# EAGLE design atarimovie (EAGLE 9.6.2)
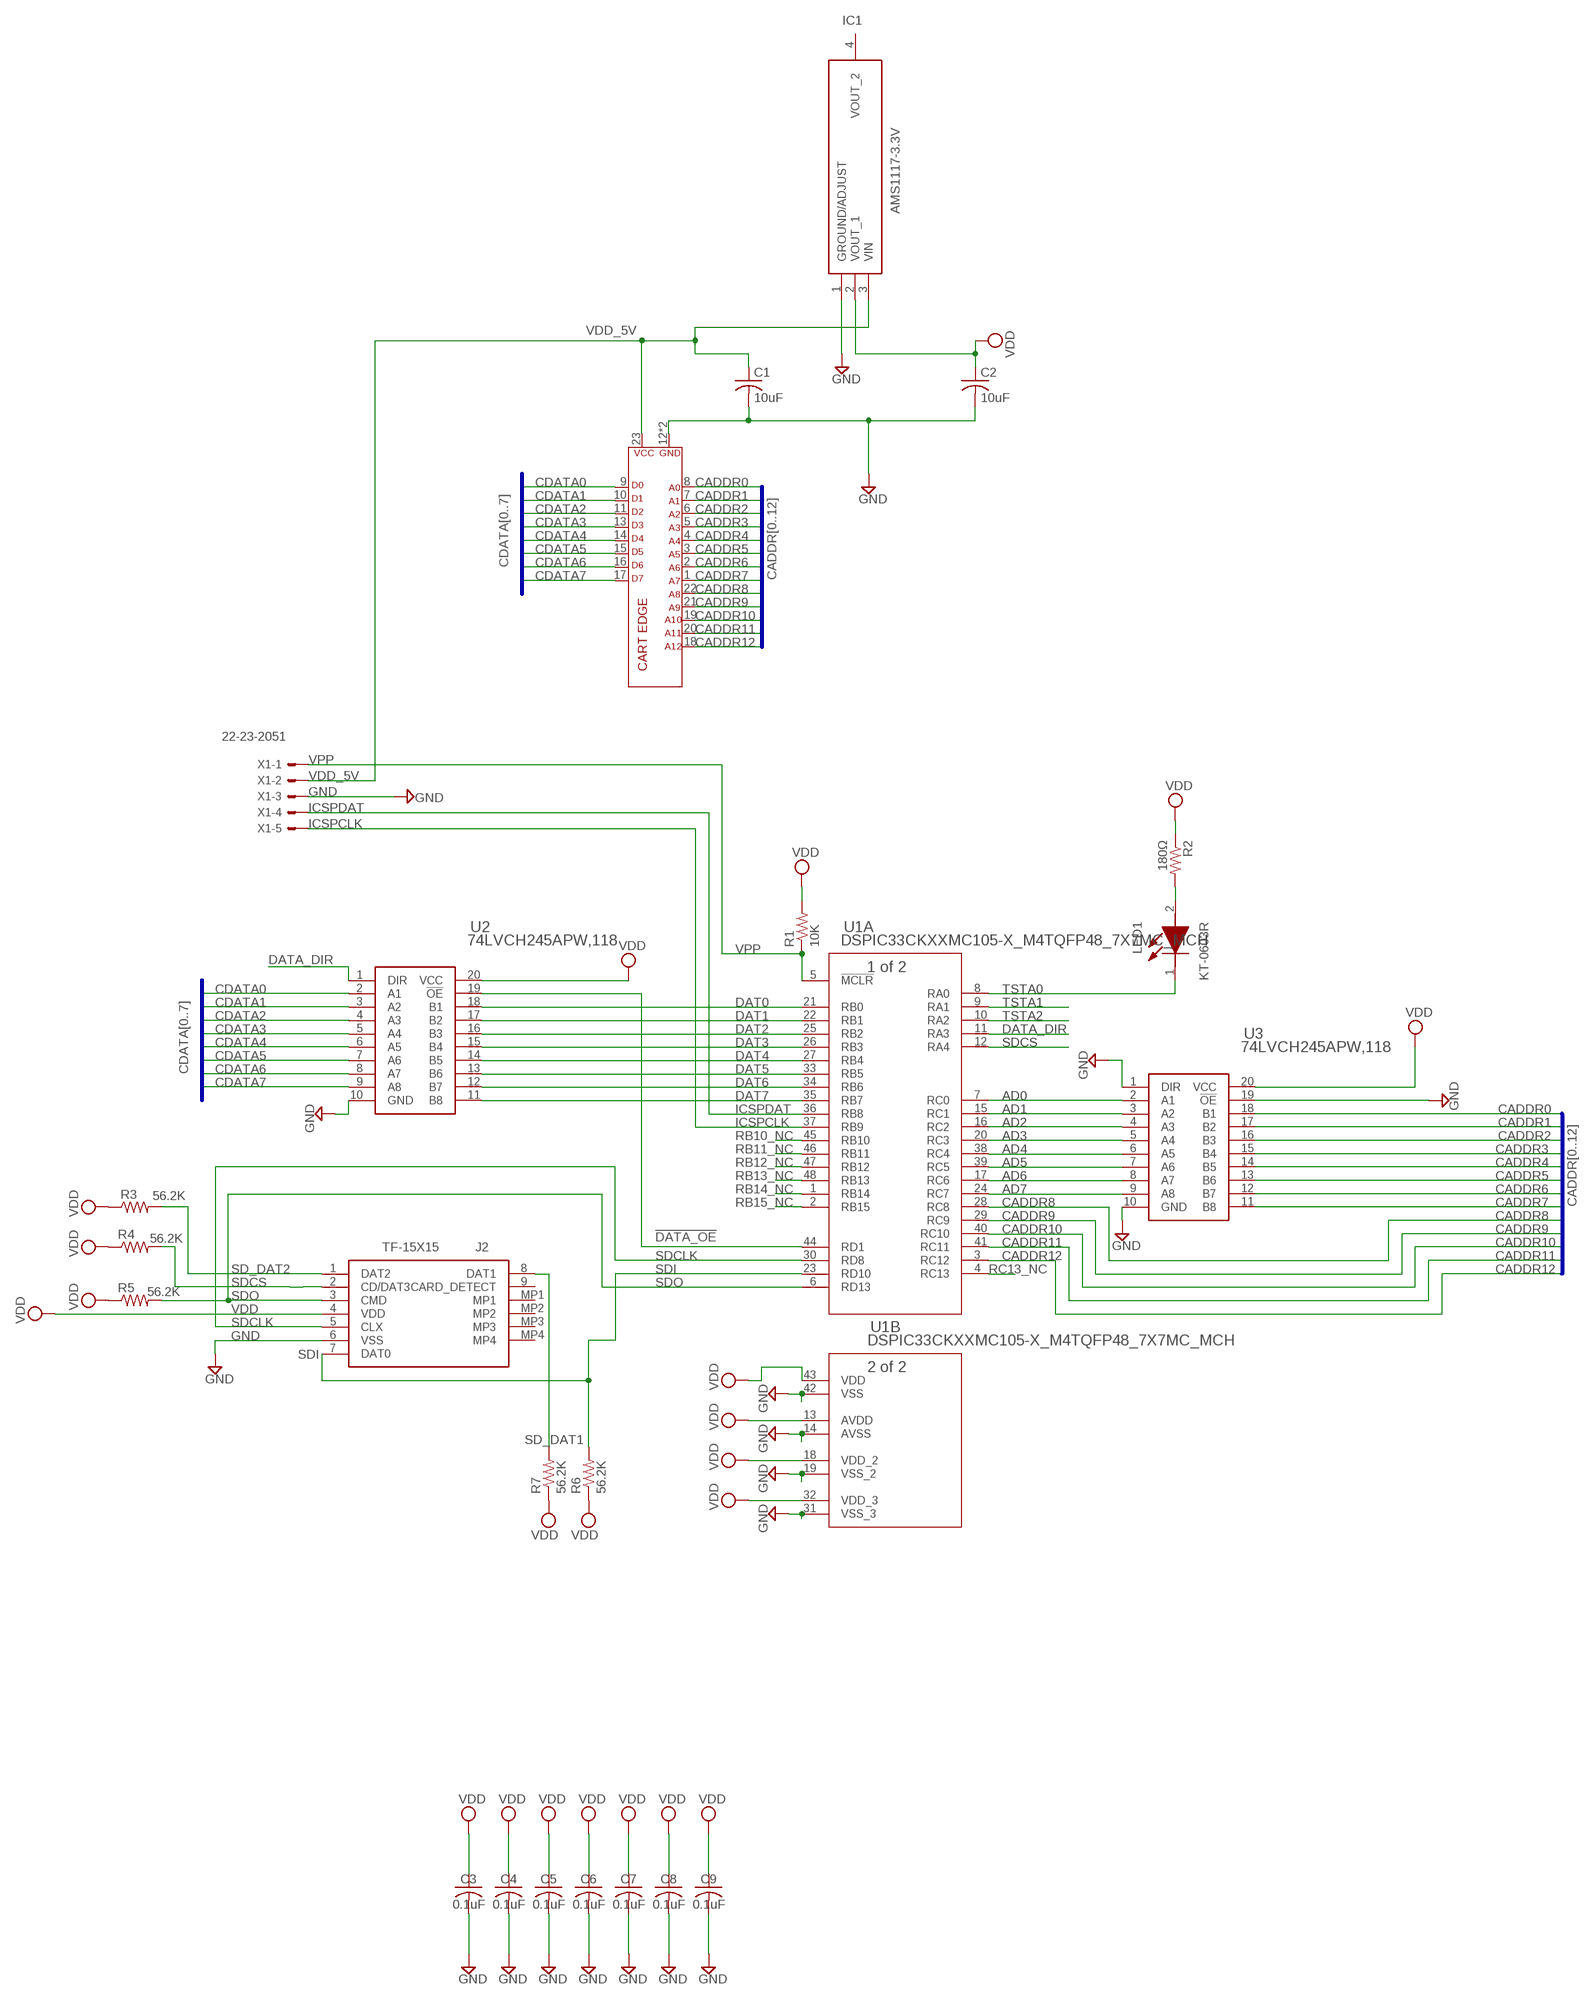
[diagram p0: schematic, sheet 1]

## Parts
C1  10uF  C-USC0603K  [C0603K]
C2  10uF  C-USC0603K  [C0603K]
C3  0.1uF  C-USC0603K  [C0603K]
C4  0.1uF  C-USC0603K  [C0603K]
C5  0.1uF  C-USC0603K  [C0603K]
C6  0.1uF  C-USC0603K  [C0603K]
C7  0.1uF  C-USC0603K  [C0603K]
C8  0.1uF  C-USC0603K  [C0603K]
C9  0.1uF  C-USC0603K  [C0603K]
IC1  AMS1117-3.3V  [SOT229P700X180-4N]
J1  CARTRIDGE EDGE  ATARI-2600MED_TABS_SHORT  [MED_TABS_SHORT]
J2  TF-15X15  [TF15X15]
LED1  KT-0603R  [LEDC1608X70N]
R1  10K  R-US_R0603  [R0603]
R2  180Ω  R-US_R0603  [R0603]
R3  56.2K  R-US_R0603  [R0603]
R4  56.2K  R-US_R0603  [R0603]
R5  56.2K  R-US_R0603  [R0603]
R6  56.2K  R-US_R0603  [R0603]
R7  56.2K  R-US_R0603  [R0603]
U1  DSPIC33CKXXMC105-X_M4TQFP48_7X7MC_MCH  [TQFP48_7X7MC_MCH]
U2  74LVCH245APW,118  [SOP65P640X110-20N]
U3  74LVCH245APW,118  [SOP65P640X110-20N]
X1  22-23-2051  [22-23-2051]

## Nets
!DATA_OE!: U1.44(A:RD1) U2.19(!OE)
AD0: U1.7(A:RC0) U3.2(A1)
AD1: U1.15(A:RC1) U3.3(A2)
AD2: U1.16(A:RC2) U3.4(A3)
AD3: U1.20(A:RC3) U3.5(A4)
AD4: U1.38(A:RC4) U3.6(A5)
AD5: U1.39(A:RC5) U3.7(A6)
AD6: U1.17(A:RC6) U3.8(A7)
AD7: U1.24(A:RC7) U3.9(A8)
CADDR0: J1.8(A0) U3.18(B1)
CADDR1: J1.7(A1) U3.17(B2)
CADDR2: J1.6(A2) U3.16(B3)
CADDR3: J1.5(A3) U3.15(B4)
CADDR4: J1.4(A4) U3.14(B5)
CADDR5: J1.3(A5) U3.13(B6)
CADDR6: J1.2(A6) U3.12(B7)
CADDR7: J1.1(A7) U3.11(B8)
CADDR8: J1.22(A8) U1.28(A:RC8)
CADDR9: J1.21(A9) U1.29(A:RC9)
CADDR10: J1.19(A10) U1.40(A:RC10)
CADDR11: J1.20(A11) U1.41(A:RC11)
CADDR12: J1.18(A12) U1.3(A:RC12)
CDATA0: J1.9(D0) U2.2(A1)
CDATA1: J1.10(D1) U2.3(A2)
CDATA2: J1.11(D2) U2.4(A3)
CDATA3: J1.13(D3) U2.5(A4)
CDATA4: J1.14(D4) U2.6(A5)
CDATA5: J1.15(D5) U2.7(A6)
CDATA6: J1.16(D6) U2.8(A7)
CDATA7: J1.17(D7) U2.9(A8)
DAT0: U1.21(A:RB0) U2.18(B1)
DAT1: U1.22(A:RB1) U2.17(B2)
DAT2: U1.25(A:RB2) U2.16(B3)
DAT3: U1.26(A:RB3) U2.15(B4)
DAT4: U1.27(A:RB4) U2.14(B5)
DAT5: U1.33(A:RB5) U2.13(B6)
DAT6: U1.34(A:RB6) U2.12(B7)
DAT7: U1.35(A:RB7) U2.11(B8)
DATA_DIR: U1.11(A:RA3) U2.1(DIR)
GND: C1.2 C2.2 C3.2 C4.2 C5.2 C6.2 C7.2 C8.2 C9.2 IC1.1(GROUND/ADJUST) J1.12(GND) J1.24(GND) J2.6(VSS) U1.14(B:AVSS) U1.19(B:VSS_2) U1.31(B:VSS_3) U1.42(B:VSS) U2.10(GND) U3.1(DIR) U3.10(GND) U3.19(!OE) X1.3
ICSPCLK: U1.37(A:RB9) X1.5
ICSPDAT: U1.36(A:RB8) X1.4
N$1: LED1.2(A) R2.2
RB10_NC: U1.45(A:RB10)
RB11_NC: U1.46(A:RB11)
RB12_NC: U1.47(A:RB12)
RB13_NC: U1.48(A:RB13)
RB14_NC: U1.1(A:RB14)
RB15_NC: U1.2(A:RB15)
RC13_NC: U1.4(A:RC13)
SD_DAT1: J2.8(DAT1) R7.2
SD_DAT2: J2.1(DAT2) R3.2
SDCLK: J2.5(CLX) U1.30(A:RD8)
SDCS: J2.2(CD/DAT3) R4.2 U1.12(A:RA4)
SDI: J2.7(DAT0) R6.2 U1.23(A:RD10)
SDO: J2.3(CMD) R5.2 U1.6(A:RD13)
TSTA0: LED1.1(K) U1.8(A:RA0)
TSTA1: U1.9(A:RA1)
TSTA2: U1.10(A:RA2)
VDD: C2.1 C3.1 C4.1 C5.1 C6.1 C7.1 C8.1 C9.1 IC1.2(VOUT_1) J2.4(VDD) R1.2 R2.1 R3.1 R4.1 R5.1 R6.1 R7.1 U1.13(B:AVDD) U1.18(B:VDD_2) U1.32(B:VDD_3) U1.43(B:VDD) U2.20(VCC) U3.20(VCC)
VDD_5V: C1.1 IC1.3(VIN) J1.23(VCC) X1.2
VPP: R1.1 U1.5(A:!MCLR) X1.1
Unconnected: IC1.4(VOUT_2) J2.9(CARD_DETECT) J2.MP1 J2.MP2 J2.MP3 J2.MP4

## Buses
CADDR[0..12]
CDATA[0..7]

## Library data of the parts
C1-C9 = rcl:C-US: CAPACITOR, American symbol; SPICEPREFIX: C
IC1 = ams1117-3.3v:AMS1117-3.3V: 1A LOW DROPOUT VOLTAGE REGULATOR, SOT-223 Source: Datasheet <http://www.advanced-monolithic.com/pdf/ds1117.pdf>; DESCRIPTION: 1A LOW DROPOUT VOLTAGE REGULATOR, SOT-223; HEIGHT: 1.8mm; MANUFACTURER_NAME: Advanced Monolithic Systems; MANUFACTURER_PART_NUMBER: ams1117-3.3v
J1 = a26board:ATARI-2600: Atari 2600 cartridge board
J2 = TF-15X15:TF-15X15: Micro-SD Card Socket Source: Datasheet <https://datasheet.lcsc.com/szlcsc/SOFNG-TF-15-15_C111196.pdf>; DESCRIPTION: Micro-SD Card Socket; HEIGHT: 1.85mm; MANUFACTURER_NAME: SOFNG; MANUFACTURER_PART_NUMBER: TF-15X15
LED1 = KT-0603R:KT-0603R: Red 615~630nm 1.9~2.2V 0603 Light Emitting Diodes (LED) RoHS Source: Datasheet <https://datasheet.lcsc.com/szlcsc/Hubei-KENTO-Elec-KT-0603R_C2286.pdf>; DESCRIPTION: Red 615~630nm 1.9~2.2V 0603 Light Emitting Diodes (LED) RoHS; HEIGHT: 0.7mm; MANUFACTURER_NAME: Hubei KENTO Elec; MANUFACTURER_PART_NUMBER: KT-0603R
R1-R7 = resistor:R-US_: RESISTOR, American symbol
U1 = parts_mc2:DSPIC33CKXXMC105-X_M4: IC MCU 16BIT 32KB FLASH 48UQFN
U2 U3 = 74LVCH245APW_118:74LVCH245APW,118: 74LVC(H)245A - Octal bus transceiver; 3-state@en-us Source: Datasheet <https://assets.nexperia.com/documents/data-sheet/74LVC_LVCH245A.pdf>; DESCRIPTION: 74LVC(H)245A - Octal bus transceiver; 3-state@en-us; HEIGHT: 1.1mm; MANUFACTURER_NAME: Nexperia; MANUFACTURER_PART_NUMBER: 74LVCH245APW,118; MOUSER_PART_NUMBER: 771-74LVCH245APW-T; MOUSER_PRICE-STOCK: https://www.mouser.co.uk/ProductDetail/Nexperia/74LVCH245APW118?qs=me8TqzrmIYU8gTXvbc8b4g%3D%3D
X1 = con-molex:22-23-2051: .100" (2.54mm) Center Header - 5 Pin; MF: MOLEX; MPN: 22-23-2051; OC_FARNELL: 1462952; OC_NEWARK: 38C9178

## Board
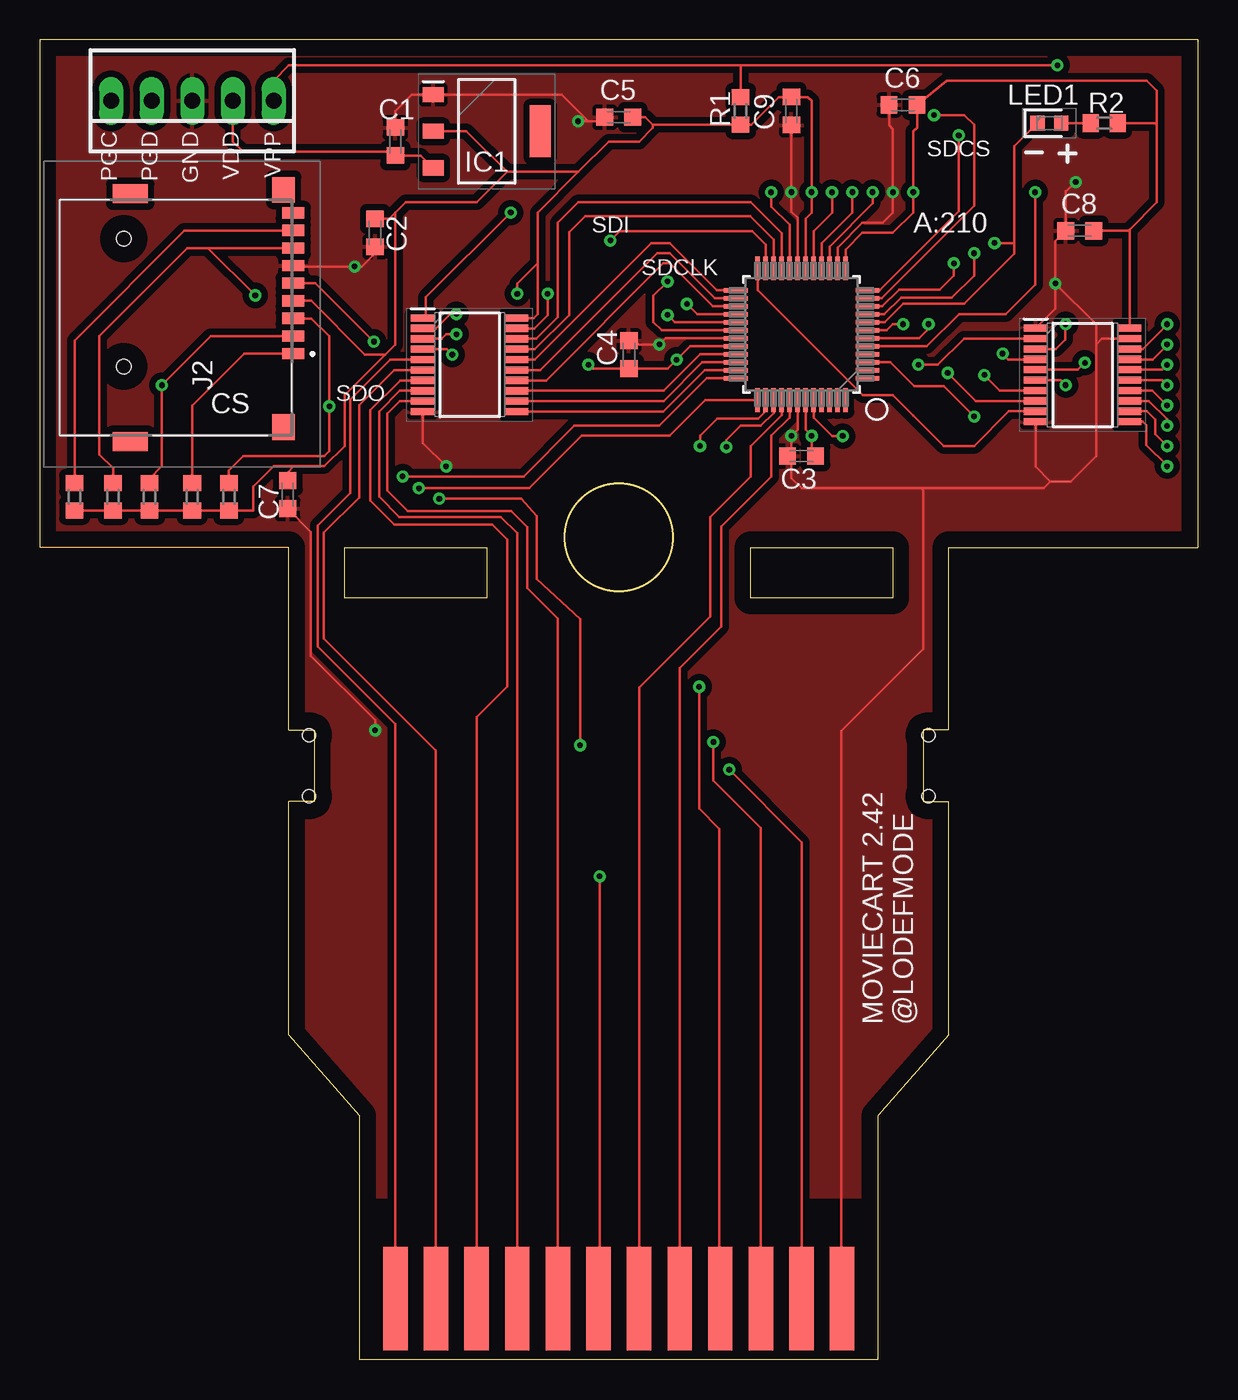
[diagram p1: board, top side]
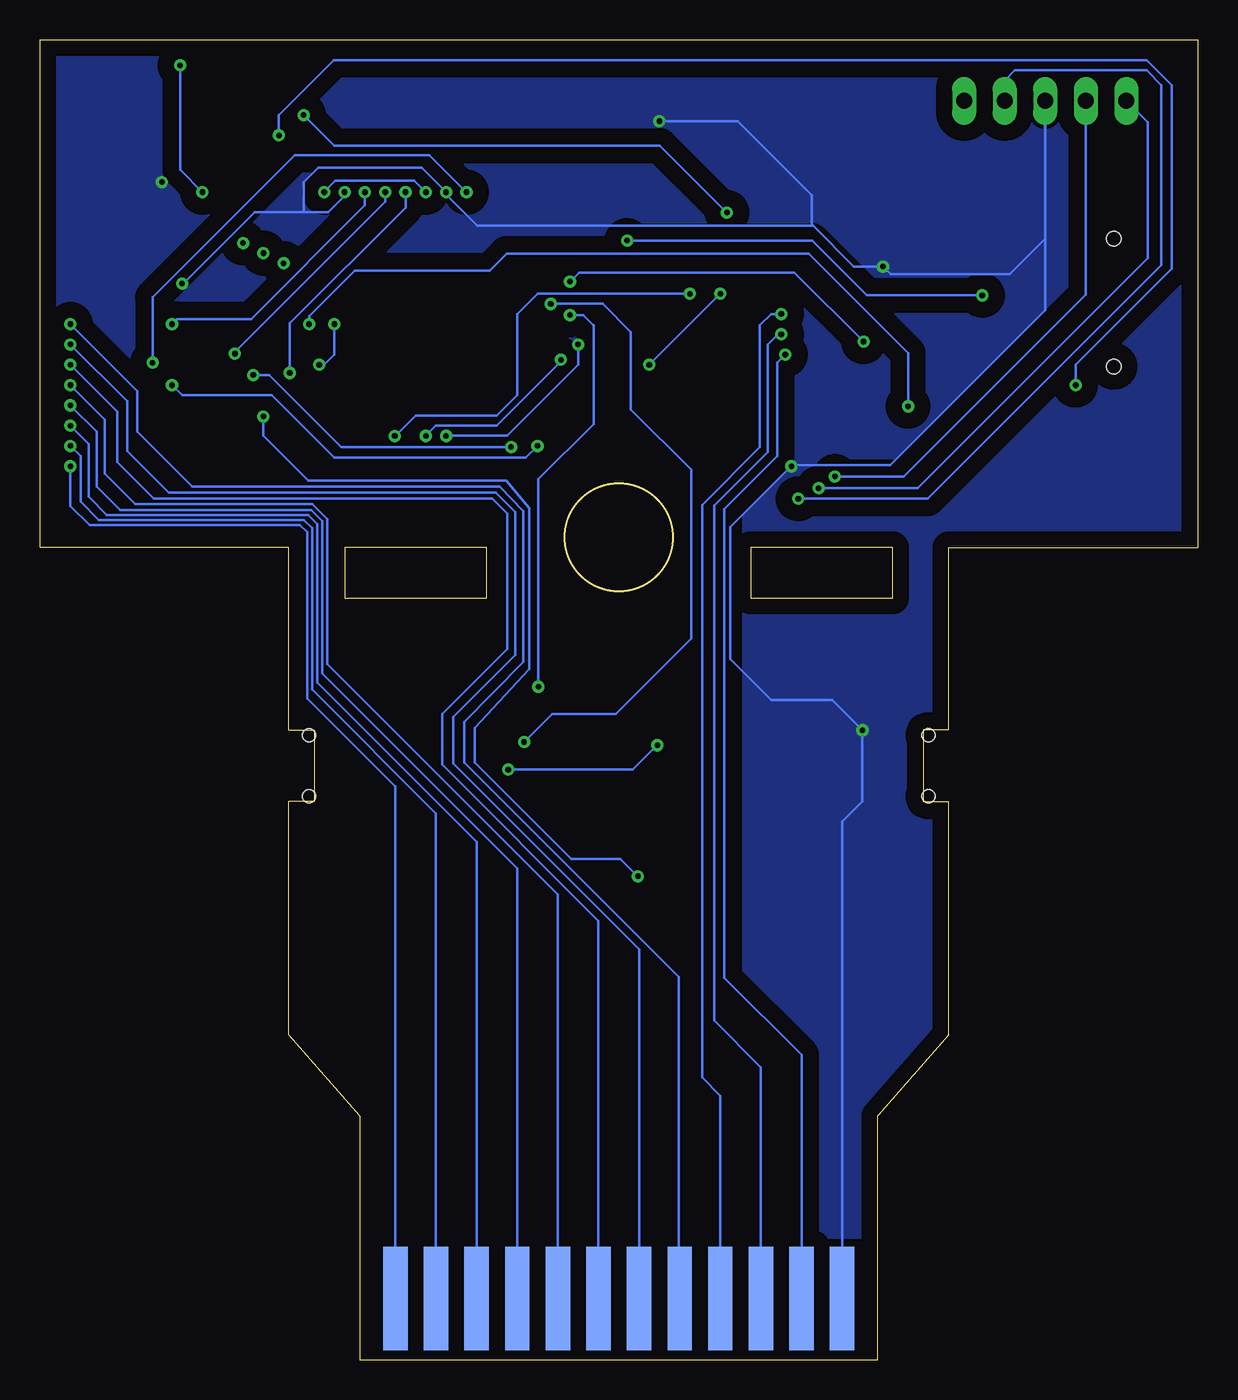
[diagram p2: board, bottom side, seen from below]

Size 72.39 x 82.55 mm. Coordinates in mm from the lower left corner, seen from the top.
Copper layers (1*16): Top 0.035mm / dielectric 1.5mm / Bottom 0.035mm
Design rules "default": minimum track width 6mil, minimum drill 0.35mm, track to track 6mil, track to pad 6mil, pad to pad 6mil, via to via 6mil, smd to smd 6mil, copper to edge 40mil, drill to drill 6mil, minimum pad ring 10mil, minimum via ring 8mil, stop-mask expansion 4mil, vias tented up to drill 0mil, thermal gap 10mil

### Footprints (pad centres in the part's own frame; a part is rotated, then mirrored left to right if it is on the bottom)
C0603K = smd 1.05 x 1.08: 1 -0.875,0; 2 0.875,0
SOT229P700X180-4N = smd 1.3 x 0.95: 1 -3.35,2.29; 2 -3.35,0; 3 -3.35,-2.29 | smd 1.3 x 3.25: 4 3.35,0
MED_TABS_SHORT = smd 1.524 x 6.477: 1 -13.97,-46.99; 2 -11.43,-46.99; 3 -8.89,-46.99; 4 -6.35,-46.99; 5 -3.81,-46.99; 6 -1.27,-46.99; 7 1.27,-46.99; 8 3.81,-46.99; 9 6.35,-46.99; 10 8.89,-46.99; 11 11.43,-46.99; 12 13.97,-46.99 | smd 1.524 x 6.477 bottom: 13 13.97,-46.99; 14 11.43,-46.99; 15 8.89,-46.99; 16 6.35,-46.99; 17 3.81,-46.99; 18 1.27,-46.99; 19 -1.27,-46.99; 20 -3.81,-46.99; 21 -6.35,-46.99; 22 -8.89,-46.99; 23 -11.43,-46.99; 24 -13.97,-46.99 | hole 0.8: -19.367,-11.748; -19.367,-15.557; 19.367,-11.748; 19.367,-15.557
TF15X15 = smd 0.7 x 1.4: 1 2.475,6.95; 2 1.375,6.95; 3 0.275,6.95; 4 -0.825,6.95; 5 -1.925,6.95; 6 -3.025,6.95; 7 -4.125,6.95; 8 -5.225,6.95; 9 -6.325,6.95 | smd 1.6 x 1.4: MP1 -7.775,6.35; MP2 7.075,6.35 | smd 1.2 x 2.2: MP3 -7.525,-3.25; MP4 7.975,-3.25 | hole 0.9: -4.725,-3.65; 3.275,-3.65
LEDC1608X70N = smd 0.9 x 0.95: 1 -0.75,0; 2 0.75,0
R0603 = smd 1 x 1.1: 1 -0.85,0; 2 0.85,0
TQFP48_7X7MC_MCH = smd 1.473 x 0.279: 1 -4.115,2.75; 2 -4.115,2.25; 3 -4.115,1.75; 4 -4.115,1.25; 5 -4.115,0.75; 6 -4.115,0.25; 7 -4.115,-0.25; 8 -4.115,-0.75; 9 -4.115,-1.25; 10 -4.115,-1.75; 11 -4.115,-2.25; 12 -4.115,-2.75; 25 4.115,-2.75; 26 4.115,-2.25; 27 4.115,-1.75; 28 4.115,-1.25; 29 4.115,-0.75; 30 4.115,-0.25; 31 4.115,0.25; 32 4.115,0.75; 33 4.115,1.25; 34 4.115,1.75; 35 4.115,2.25; 36 4.115,2.75 | smd 0.279 x 1.473: 13 -2.75,-4.115; 14 -2.25,-4.115; 15 -1.75,-4.115; 16 -1.25,-4.115; 17 -0.75,-4.115; 18 -0.25,-4.115; 19 0.25,-4.115; 20 0.75,-4.115; 21 1.25,-4.115; 22 1.75,-4.115; 23 2.25,-4.115; 24 2.75,-4.115; 37 2.75,4.115; 38 2.25,4.115; 39 1.75,4.115; 40 1.25,4.115; 41 0.75,4.115; 42 0.25,4.115; 43 -0.25,4.115; 44 -0.75,4.115; 45 -1.25,4.115; 46 -1.75,4.115; 47 -2.25,4.115; 48 -2.75,4.115
SOP65P640X110-20N = smd 1.475 x 0.45: 1 -2.938,2.925; 2 -2.938,2.275; 3 -2.938,1.625; 4 -2.938,0.975; 5 -2.938,0.325; 6 -2.938,-0.325; 7 -2.938,-0.975; 8 -2.938,-1.625; 9 -2.938,-2.275; 10 -2.938,-2.925; 11 2.938,-2.925; 12 2.938,-2.275; 13 2.938,-1.625; 14 2.938,-0.975; 15 2.938,-0.325; 16 2.938,0.325; 17 2.938,0.975; 18 2.938,1.625; 19 2.938,2.275; 20 2.938,2.925
22-23-2051 = drill 1 long: 1 -5.08,0; 2 -2.54,0; 3 0,0; 4 2.54,0; 5 5.08,0

### Placement (x,y rotation side)
C1  22.23,76.2 90 top
C2  20.96,70.48 270 top
C3  47.62,56.52 180 top
C4  36.83,62.87 90 top
C5  36.2,77.72 180 top
C6  53.98,78.49 180 top
C7  15.49,54.1 270 top
C8  65.02,70.61 180 top
C9  46.99,78.11 270 top
IC1  27.94,76.83 0 top
J1  36.2,50.8 0 bottom
J2  8.89,65.41 270 top
LED1  63.12,77.34 0 top
R1  43.82,78.11 270 top
R2  66.55,77.34 180 top
R3  9.53,53.98 90 top
R4  6.86,53.98 90 top
R5  11.81,53.98 90 top
R6  4.57,53.98 90 top
R7  2.16,53.98 90 top
U1  47.62,64.14 180 top
U2  26.87,62.23 0 top
U3  65.2,61.59 0 top
X1  9.53,78.74 180 top

### Tracks (layer width: path | path; a pad name or v marks a point on that pad's centre or on a via)
!DATA_OE!  (via drill 0.35)
  Top 0.152: U2.19 30.91,64.5 31.75,65.34 v31.75,66.67 | v50.2,57.77 49.54,57.77 48.38,58.94 U1.44
  Bottom 0.152: v31.75,66.67 41.27,66.67 42.55,65.41 42.55,60.33 43.82,59.05 48.9,59.05 50.18,57.77 v50.2,57.77
AD0  (via drill 0.35)
  Top 0.152: U3.2 57.79,63.87 56.15,62.23 v54.93,62.23 | v53.98,64.77 53.34,64.77 52.96,64.39 U1.7
  Bottom 0.152: v53.98,64.77 53.98,62.87 54.61,62.23 v54.93,62.23
AD1  (via drill 0.35)
  Top 0.152: v64.13,64.77 64.12,64.75 64.12,63.8 63.54,63.22 U3.3 | U1.15 49.38,69.63 52.07,72.33 v52.07,73.03
  Bottom 0.152: v52.07,73.03 52.07,72.2 59.18,65.09 63.82,65.09 v64.13,64.77
AD2  (via drill 0.35)
  Top 0.152: U3.4 60.56,62.57 v60.2,62.93 | U1.16 48.88,69.83 50.8,71.75 v50.8,73.03
  Bottom 0.152: v50.8,73.03 50.8,72.44 60.26,62.99 v60.2,62.93
AD3  (via drill 0.35)
  Top 0.152: v65.34,62.36 64.9,61.92 U3.5 | U1.20 46.88,70.98 45.72,72.14 v45.72,73.03
  Bottom 0.152: v65.34,62.36 65.34,66.46 56.46,75.34 48.03,75.34 v45.72,73.03
AD4  (via drill 0.35)
  Top 0.152: v64.13,60.96 63.83,61.27 U3.6 | v41.27,57.15 41.27,57.78 42.35,58.86 44.92,58.86 45.38,59.32 U1.38
  Bottom 0.152: v41.27,57.15 42.01,56.41 53.98,56.41 57.89,60.33 63.5,60.33 v64.13,60.96
AD5  (via drill 0.35)
  Top 0.152: U3.7 60.03,60.62 v59.05,61.59 | v42.93,57.09 42.93,57.53 43.82,58.42 45.09,58.42 45.88,59.21 U1.39
  Bottom 0.152: v42.93,57.09 53.56,57.09 58.06,61.59 v59.05,61.59
AD6  (via drill 0.35)
  Top 0.152: v56.77,61.72 58.52,59.97 U3.8 | U1.17 48.38,70.6 49.53,71.75 v49.53,73.03
  Bottom 0.152: v56.77,61.72 56.77,64.82 49.53,72.06 v49.53,73.03
AD7
  Top 0.152: U1.24 44.88,66.9 51.44,60.33 53.33,60.33 54.61,59.05 54.62,59.05 56.52,57.15 58.42,57.15 60.59,59.32 U3.9
CADDR0  (via drill 0.35)
  Top 0.152: U3.18 68.96,63.22 70.49,64.74 v70.49,64.77
  Bottom 0.152: v70.49,64.77 66.29,60.58 66.29,58.04 62.87,54.61 43.62,54.61 42.16,53.09 42.16,43.62 45.85,39.88 45.85,37.34 32.44,23.93 32.44,3.81 J1.8
CADDR1  (via drill 0.35)
  Top 0.152: U3.17 69.58,62.57 70.49,63.47 v70.49,63.5
  Bottom 0.152: v70.49,63.5 66.93,59.94 66.93,56.83 64.32,54.23 43.88,54.23 42.67,53.02 42.67,44.07 46.55,40.2 46.55,37.27 34.93,25.65 34.93,6.4 34.87,6.4 34.87,3.81 J1.7
CADDR2  (via drill 0.35)
  Top 0.152: U3.16 70.17,61.92 v70.49,62.23
  Bottom 0.152: v70.49,62.23 67.56,59.31 67.56,56.13 65.28,53.85 44.12,53.85 43.18,52.91 43.18,44.45 47.24,40.39 47.24,37.21 37.47,27.43 J1.6
CADDR3  (via drill 0.35)
  Top 0.152: U3.15 70.18,61.27 v70.49,60.96
  Bottom 0.152: v70.49,60.96 68.33,58.8 68.33,55.44 66.42,53.53 55.37,53.53 54.43,52.59 54.43,43.51 40.01,29.08 J1.5
CADDR4  (via drill 0.35)
  Top 0.152: U3.14 69.56,60.62 v70.49,59.69
  Bottom 0.152: J1.4 42.55,30.73 54.74,42.93 54.74,52.45 55.44,53.15 67.37,53.15 68.83,54.61 68.83,58.04 v70.49,59.69
CADDR5  (via drill 0.35)
  Top 0.152: U3.13 69.35,59.97 70.49,58.83 v70.49,58.42
  Bottom 0.152: J1.3 45.09,32.38 55.05,42.35 55.05,52.26 55.63,52.83 68.2,52.83 69.34,53.98 69.34,57.28 v70.49,58.42
CADDR6  (via drill 0.35)
  Top 0.152: v70.49,57.15 69.74,57.89 69.74,58.8 69.22,59.32 U3.12
  Bottom 0.152: J1.2 47.62,34.16 55.37,41.91 55.37,52.01 55.88,52.51 68.71,52.51 69.85,53.66 69.85,56.52 v70.49,57.15
CADDR7  (via drill 0.35)
  Top 0.152: U3.11 68.97,58.67 69.18,58.45 69.18,57.21 70.49,55.91 v70.49,55.88
  Bottom 0.152: J1.1 50.16,35.84 55.69,41.36 55.69,51.75 56.13,52.2 69.28,52.2 70.49,53.4 v70.49,55.88
CADDR8  (via drill 0.35)
  Top 0.152: v42.11,38.63 42.11,36.22 45.09,33.25 J1.22 | U1.28 41.1,65.39 v40.45,66.04
  Bottom 0.152: v40.45,66.04 37.2,66.04 35.43,64.28 35.43,59.44 31.67,55.67 31.67,45.11 36.4,40.38 40.36,40.38 v42.11,38.63
CADDR9  (via drill 0.35)
  Top 0.152: J1.21 42.49,3.81 42.49,33.2 41.22,34.47 v41.22,42.09 | U1.29 39.7,64.89 v39.24,65.34
  Bottom 0.152: v39.24,65.34 38.42,65.34 37.78,64.71 37.77,64.71 37.77,58.52 41.22,55.07 v41.22,42.09
CADDR10
  Top 0.152: J1.19 37.47,42.04 41.91,46.48 41.91,52.7 44.45,55.24 44.45,57.15 46.38,59.08 U1.40
CADDR11
  Top 0.152: J1.20 40.01,43.26 42.6,45.85 42.6,52.12 45.72,55.24 45.72,57.78 46.88,58.94 U1.41
CADDR12  (via drill 0.35)
  Top 0.152: v35,30.23 35,3.81 J1.18 | v58.42,58.99 56.52,60.9 54.67,60.9 53.19,62.38 U1.3
  Bottom 0.152: v58.42,58.99 58.42,57.78 55.63,54.99 43.23,54.99 41.78,53.28 41.78,43.19 45.19,39.52 45.19,37.36 39.15,31.33 36.11,31.33 v35,30.23
CDATA0  (via drill 0.35)
  Top 0.152: U2.2 24.75,64.5 25.65,65.41 v26.04,65.41
  Bottom 0.152: J1.9 29.85,16.51 30.99,17.65 30.99,53.47 27.37,57.09 27.37,64.71 26.67,65.41 v26.04,65.41
CDATA1  (via drill 0.35)
  Top 0.152: U2.3 25.12,63.85 25.4,64.14 v26.04,64.14
  Bottom 0.152: v26.04,64.14 26.23,64.14 26.87,63.49 26.87,56.77 30.23,53.42 30.23,21.21 27.31,18.29 J1.10
CDATA2  (via drill 0.35)
  Top 0.152: U2.4 25.44,63.2 v25.78,62.87
  Bottom 0.152: v25.78,62.87 26.29,62.36 26.29,56.52 29.59,53.21 29.59,23.88 24.77,19.05 J1.11
CDATA3
  Top 0.152: J1.13 22.23,39.75 17.37,44.6 17.37,52.17 19.41,54.2 19.41,60.05 21.91,62.55 U2.5
CDATA4
  Top 0.152: J1.14 24.77,38.1 17.76,45.11 17.76,51.73 19.96,53.94 19.96,59.72 22.15,61.9 U2.6
CDATA5
  Top 0.152: J1.15 27.31,40.21 29.21,42.11 29.21,51.31 28.3,52.22 22.15,52.22 20.65,53.72 20.65,59.38 22.52,61.25 U2.7
CDATA6
  Top 0.152: J1.16 29.85,51.69 28.83,52.7 22.48,52.7 21.21,53.98 21.21,59.31 22.5,60.6 U2.8
CDATA7
  Top 0.152: J1.17 32.39,46.35 30.48,48.26 30.48,52.07 29.46,53.09 22.99,53.09 21.72,54.36 21.72,59.18 22.49,59.95 U2.9
DAT0
  Top 0.152: U2.18 31.02,63.85 32.39,65.22 32.39,71.12 33.66,72.39 44.45,72.39 46.38,70.47 U1.21
DAT1
  Top 0.152: U2.17 30.95,63.2 33.08,65.34 33.08,67.35 33.1,67.36 33.1,70.54 34.09,71.53 44.41,71.53 45.88,70.06 U1.22
DAT2
  Top 0.152: U2.16 30.93,62.55 38.23,69.85 39.37,69.85 42.34,66.89 U1.25
DAT3
  Top 0.152: U2.15 31.3,61.9 38.61,69.22 39.37,69.22 42.2,66.39 U1.26
DAT4
  Top 0.152: U2.14 31.66,61.25 38.99,68.58 39.37,68.58 42.07,65.89 U1.27
DAT5
  Top 0.152: U2.13 39.01,60.6 41.3,62.88 U1.33
DAT6
  Top 0.152: U2.12 39,59.95 41.43,62.38 U1.34
DAT7
  Top 0.152: U2.11 38.73,59.3 38.98,59.3 41.57,61.88 U1.35
DATA_DIR  (via drill 0.35)
  Top 0.152: v55.91,77.85 57.81,77.85 58.42,77.24 58.42,72.17 52.63,66.39 U1.11 | v29.44,71.75 24.13,66.45 24.13,65.35 U2.1
  Bottom 0.152: v55.91,77.85 54,75.95 33.63,75.95 v29.44,71.75
GND  (via drill 0.35)
  Top 0.152: 46.99,56.52 v46.99,57.78 47.38,58.17 U1.42 | v63.5,67.31 63.5,69.96 C8.2 64.15,73.08 64.16,73.05 v64.77,73.66 | C4.2 37.23,63.74 37.47,63.5 v38.73,63.5 39.12,63.88 U1.31 | J1.24 50.11,3.81 50.11,39.32 55.25,44.45 55.25,54.36 55.09,54.51 | C3.2 46.99,56.52 | 55.09,54.51 47.62,54.51 46.99,55.14 46.99,56.52 | U2.10 23.94,57.34 v25.4,55.88 | 66.04,63.5 66.41,63.87 U3.19 | U3.1 63.5,65.75 v63.5,67.31 | v63.5,67.31 66.04,64.77 66.04,63.5 | U3.10 62.26,55.85 63.18,54.93 | 63.18,54.93 64.45,54.93 66.04,56.52 66.04,63.5 | C5.2 35.07,77.47 34.29,77.47 | 34.29,77.47 v33.66,77.47 | 63.18,54.93 62.76,54.51 55.09,54.51 | C1.2 22.23,78.11 23.25,79.12 IC1.1 32.64,79.12 34.29,77.47 | C7.2 16.94,51.78 16.94,44.02 20.96,40.01 v20.96,39.37 | J2.6 15.89,68.38 v19.67,68.38 20.12,68.38 20.96,69.22 C2.2 | C9.2 v46.99,73.03 46.99,71.82 47.38,71.43 U1.19 | C6.2 53.1,77.22 53.34,76.98 v53.34,73.03 53.34,71.75 52.71,71.12 51.44,71.12 49.88,69.56 U1.14
  Bottom 0.152: 9.53,70.1 11.74,67.89 19.19,67.89 v19.67,68.38 21.49,68.38 24.04,70.93 24.13,70.93 | J1.12 22.23,33.66 20.96,34.92 v20.96,39.37 22.86,41.27 26.67,41.27 29.21,43.81 29.21,52.07 v25.4,55.88 25.32,55.96 19.23,55.96 9.53,65.66 9.53,70.1 | v53.34,73.03 53.34,72.8 54.36,71.78 55.88,71.78 | 55.88,71.78 58.95,71.78 63.37,67.36 v63.5,67.31 | v46.99,57.78 43.18,57.78 38.73,62.23 v38.73,63.5 | 24.13,70.93 45.03,70.93 46.99,72.89 v46.99,73.03 48.51,74.55 54.99,74.55 55.88,73.66 55.88,71.78 | v33.66,77.47 28.77,77.47 24.13,72.83 24.13,70.93 | X1.3 9.53,70.1
  pour Bottom (isolate 1.016): -5.71,7.62 74.3,7.62 74.3,85.09 -5.71,85.09
  pour Top (isolate 0.406): -3.17,10.16 74.3,10.16 74.3,85.09 -3.17,85.09
ICSPCLK  (via drill 0.35)
  Top 0.152: v23.7,54.51 30.61,54.51 33.88,57.78 39.37,57.78 41.61,60.02 U1.37
  Bottom 0.152: X1.5 3.11,77.41 3.11,68.9 17.5,54.51 v23.7,54.51
ICSPDAT  (via drill 0.35)
  Top 0.152: v22.68,55.24 30.25,55.24 33.43,58.42 38.73,58.42 41.7,61.38 U1.36
  Bottom 0.152: v22.68,55.24 18.36,55.24 6.99,66.62 X1.4
N$1
  Top 0.152: LED1.2 R2.2
SD_DAT1
  Top 0.152: J2.8 9.04,70.63 2.16,63.75 R7.2
SD_DAT2
  Top 0.152: J2.1 12.77,62.93 9.53,59.69 R3.2
SDCLK  (via drill 0.35)
  Top 0.152: v20.88,63.68 17.23,67.33 J2.5 | v39.24,67.44 38.35,66.55 38.35,64.91 38.88,64.39 U1.30
  Bottom 0.152: v20.88,63.68 25.21,68.01 38.67,68.01 v39.24,67.44
SDCS  (via drill 0.35)
  Top 0.152: J2.2 10.69,64.03 v7.62,60.96 7.62,55.88 6.86,55.12 R4.2 | U1.12 52.51,66.89 57.46,71.83 v57.46,76.58
  Bottom 0.152: v57.46,76.58 57.46,77.85 54.03,81.28 3.18,81.28 1.6,79.7 1.6,68.25 7.62,62.23 v7.62,60.96
SDI  (via drill 0.35)
  Top 0.152: v35.67,70 36.26,70.59 44.54,70.59 45.38,69.75 U1.23 | 10.51,69.53 9.21,69.53 3.7,64.02 3.7,56.63 4.57,55.75 R6.2 | 10.51,69.53 J2.7 | v13.46,66.57 10.51,69.53
  Bottom 0.152: v35.67,70 24.11,70 20.68,66.57 v13.46,66.57
SDO  (via drill 0.35)
  Top 0.152: v55.56,64.77 55.56,64.45 55,63.88 U1.6 | R5.2 11.81,55.63 12.7,56.52 17.78,56.52 18.1,56.83 v18.1,59.63 18.1,64.01 16.98,65.13 J2.3
  Bottom 0.152: v55.56,64.77 55.56,65.27 52.71,68.12 44.27,68.12 43.21,69.19 24.32,69.19 18.1,62.97 v18.1,59.63
TSTA0  (via drill 0.35)
  Top 0.152: 60.94,69.85 60.94,69.19 57.79,66.04 53.98,66.04 52.82,64.89 U1.8 | 60.94,69.85 60.94,75.91 LED1.1 | v59.69,69.85 60.94,69.85
TSTA1  (via drill 0.35)
  Top 0.152: v58.42,69.22 58.42,67.82 57.02,66.42 53.85,66.42 52.81,65.39 U1.9
TSTA2  (via drill 0.35)
  Top 0.152: v57.15,68.58 57.15,67.82 56.26,66.93 53.72,66.93 52.68,65.89 U1.10
VDD  (via drill 0.35)
  Top 0.152: C3.1 48.5,56.27 48.26,56.52 v48.26,57.78 47.88,58.17 U1.43 | 69.85,77.22 69.85,79.38 69.22,80.01 56.72,80.01 C6.1 54.85,77.08 54.61,76.83 v54.61,73.03 54.61,71.75 53.34,70.48 51.44,70.48 50.38,69.42 U1.13 | R2.1 69.72,77.34 69.85,77.22 | 68.14,70.68 69.85,72.39 69.85,77.22 | C8.1 68.07,70.61 68.14,70.68 | U2.20 30.86,65.15 31.12,65.41 31.12,68.58 | U3.20 68.14,70.68 | v34.29,62.23 34.53,61.99 C4.1 39.26,61.99 v39.82,62.55 40.65,63.38 U1.32 | C5.1 37.85,77.72 38.32,77.25 | 38.32,77.25 R1.2 44.49,77.25 46.21,78.98 C9.1 48.02,78.98 48.26,78.74 v48.26,73.03 48.26,71.75 47.88,71.37 U1.18 | 38.32,77.25 38.32,77.05 37.47,76.2 35.56,76.2 33.66,74.3 | 31.12,68.58 31.12,71.75 33.66,74.3 | IC1.2 26.67,76.83 29.21,74.3 | 21.59,62.87 22.23,63.5 22.23,71.75 | J2.4 16.96,66.23 20.32,62.87 21.59,62.87 | R7.1 R6.1 R4.1 R3.1 R5.1 13.34,53.12 13.34,54.61 14.61,55.88 15.88,55.88 | 15.88,55.88 17.78,55.88 19.05,57.15 19.05,60.33 21.59,62.87 | C7.1 15.49,55.5 15.88,55.88 | C2.1 21.83,71.36 22.23,71.75 | 22.23,71.75 22.86,72.39 27.31,72.39 29.21,74.3 | 33.66,74.3 29.21,74.3 | v29.85,66.67 29.85,67.31 31.12,68.58
  Bottom 0.152: v48.26,73.03 49,73.76 53.92,73.76 54.53,73.15 v54.61,73.03 | v48.26,57.78 47.62,58.42 43.82,58.42 39.82,62.42 v39.82,62.55 | v29.85,66.67 v34.29,62.23
VDD_5V  (via drill 0.35)
  Top 0.152: J1.23 47.65,3.83 47.65,32.36 v43.1,36.91 | v24.97,53.85 30.09,53.85 31.06,52.77 31.06,48.83 33.78,46.33 v33.78,38.43 | X1.2 12.07,76.2 12.7,75.56 21.99,75.56 C1.1 23.81,75.33 IC1.3
  Bottom 0.152: X1.2 12.07,80.01 11.43,80.64 3.18,80.64 2.26,79.73 2.26,68.47 16.88,53.85 v24.97,53.85 | v33.78,38.43 35.31,36.91 v43.1,36.91
VPP  (via drill 0.35)
  Top 0.152: 43.82,80.96 15.56,80.96 14.61,80.01 X1.1 | v62.23,73.03 62.23,67.25 60.39,65.41 57.48,65.41 55.46,63.38 U1.5 | 43.82,80.96 v63.63,80.96 | R1.1 43.82,80.96
  Bottom 0.152: v62.23,73.03 63.63,74.42 v63.63,80.96

### Text on the board
tPlace: PGC | PGD | GND | VDD | VPP | A:210 | CS | MOVIECART 2.42 | @LODEFMODE
tNames: SDCS | SDI | SDCLK | SDO